# Altium schematic sheet 0-OverView.SCHDOC
size A4
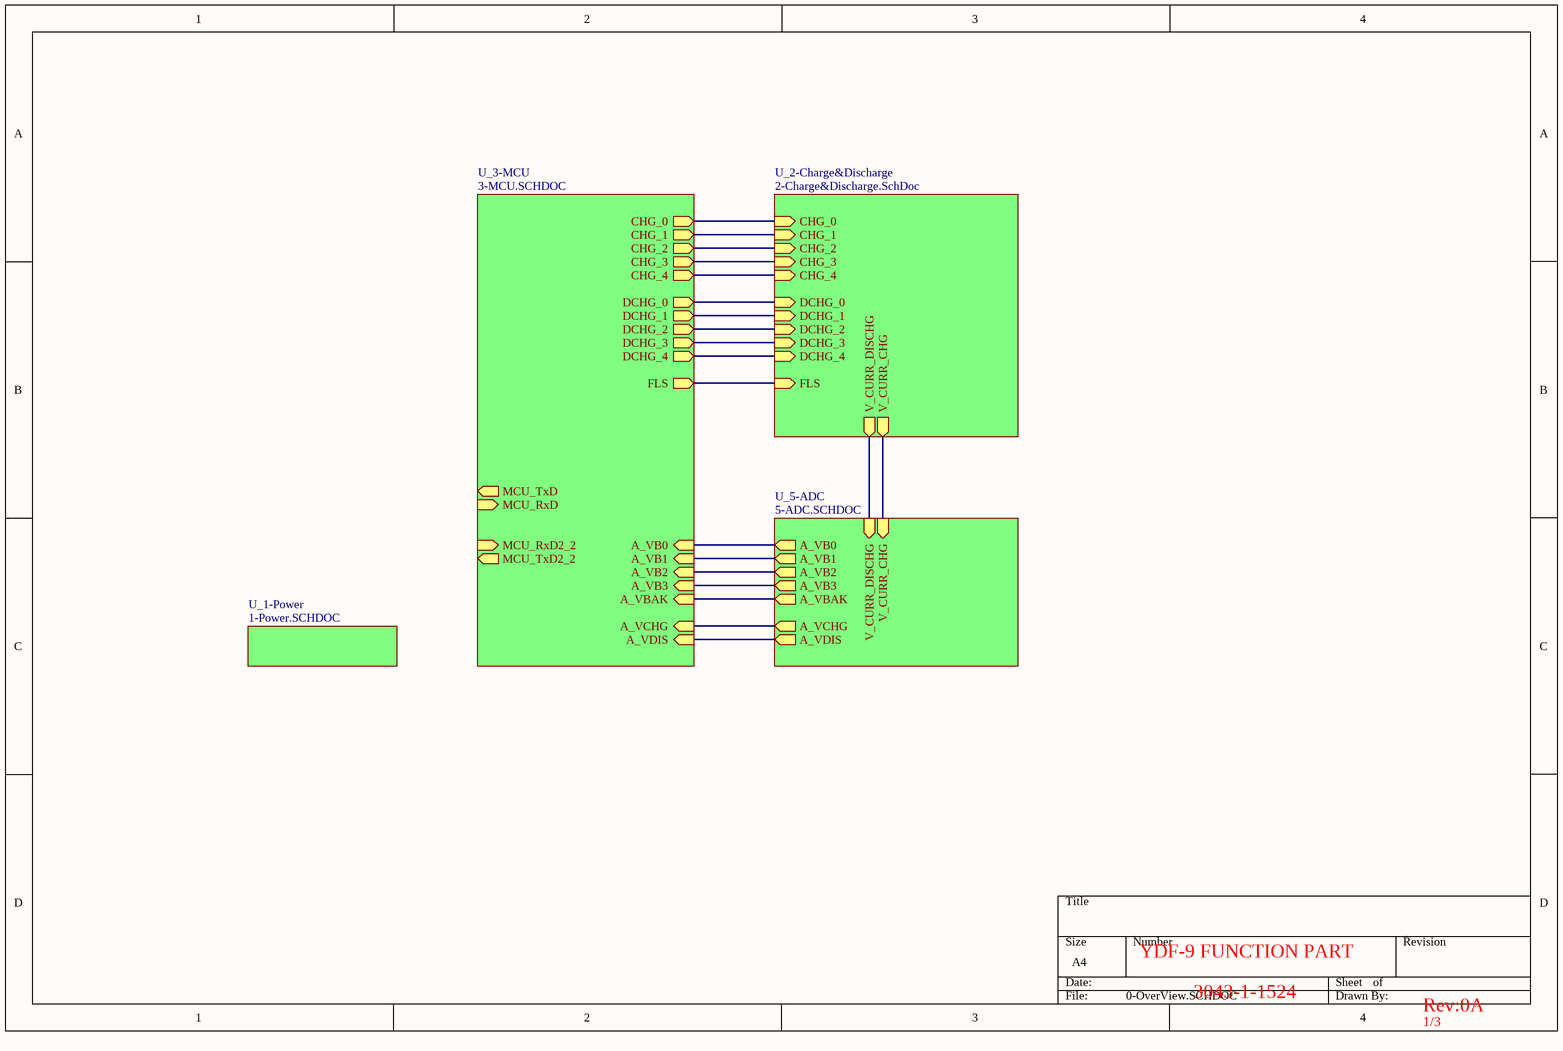
[diagram p0: 0-OverView.SCHDOC]

## Sub-sheets
U_1-Power = 1-Power.SCHDOC: no entries
U_2-Charge&Discharge = 2-Charge&Discharge.SchDoc: V_CURR_CHG (out), V_CURR_DISCHG (out), CHG_2 (in), CHG_3 (in), DCHG_0 (in), CHG_4 (in), CHG_0 (in), DCHG_1 (in), CHG_1 (in), DCHG_2 (in), DCHG_3 (in), DCHG_4 (in), FLS (in)
U_3-MCU = 3-MCU.SCHDOC: A_VDIS (in), A_VCHG (in), A_VB1 (in), A_VB2 (in), A_VB3 (in), MCU_RxD2_2 (in), MCU_TxD2_2 (out), MCU_RxD (in), CHG_3 (out), CHG_4 (out), CHG_0 (out), CHG_1 (out), CHG_2 (out), DCHG_0 (out), DCHG_1 (out), DCHG_2 (out), DCHG_3 (out), MCU_TxD (out), DCHG_4 (out), A_VB0 (in), A_VBAK (in), FLS (out)
U_5-ADC = 5-ADC.SCHDOC: A_VDIS (out), A_VB3 (out), A_VB1 (out), A_VCHG (out), A_VB2 (out), V_CURR_DISCHG (in), V_CURR_CHG (in), A_VB0 (out), A_VBAK (out)

## Nets
(unnamed): sheet U_2-Charge&Discharge/V_CURR_CHG, sheet U_5-ADC/V_CURR_CHG
(unnamed): sheet U_2-Charge&Discharge/V_CURR_DISCHG, sheet U_5-ADC/V_CURR_DISCHG
(unnamed): sheet U_2-Charge&Discharge/CHG_2, sheet U_3-MCU/CHG_2
(unnamed): sheet U_2-Charge&Discharge/CHG_3, sheet U_3-MCU/CHG_3
(unnamed): sheet U_2-Charge&Discharge/DCHG_0, sheet U_3-MCU/DCHG_0
(unnamed): sheet U_2-Charge&Discharge/CHG_4, sheet U_3-MCU/CHG_4
(unnamed): sheet U_2-Charge&Discharge/CHG_0, sheet U_3-MCU/CHG_0
(unnamed): sheet U_2-Charge&Discharge/DCHG_1, sheet U_3-MCU/DCHG_1
(unnamed): sheet U_2-Charge&Discharge/CHG_1, sheet U_3-MCU/CHG_1
(unnamed): sheet U_2-Charge&Discharge/DCHG_2, sheet U_3-MCU/DCHG_2
(unnamed): sheet U_2-Charge&Discharge/DCHG_3, sheet U_3-MCU/DCHG_3
(unnamed): sheet U_2-Charge&Discharge/DCHG_4, sheet U_3-MCU/DCHG_4
(unnamed): sheet U_2-Charge&Discharge/FLS, sheet U_3-MCU/FLS
(unnamed): sheet U_3-MCU/A_VDIS, sheet U_5-ADC/A_VDIS
(unnamed): sheet U_3-MCU/A_VCHG, sheet U_5-ADC/A_VCHG
(unnamed): sheet U_3-MCU/A_VB1, sheet U_5-ADC/A_VB1
(unnamed): sheet U_3-MCU/A_VB2, sheet U_5-ADC/A_VB2
(unnamed): sheet U_3-MCU/A_VB3, sheet U_5-ADC/A_VB3
(unnamed): sheet U_3-MCU/A_VB0, sheet U_5-ADC/A_VB0
(unnamed): sheet U_3-MCU/A_VBAK, sheet U_5-ADC/A_VBAK

## Notes on the sheet
- YDF-9 FUNCTION PART
- 3043-1-1524
- Rev:0A
- 1/3